# EAGLE design circuit (EAGLE 9.6.2)
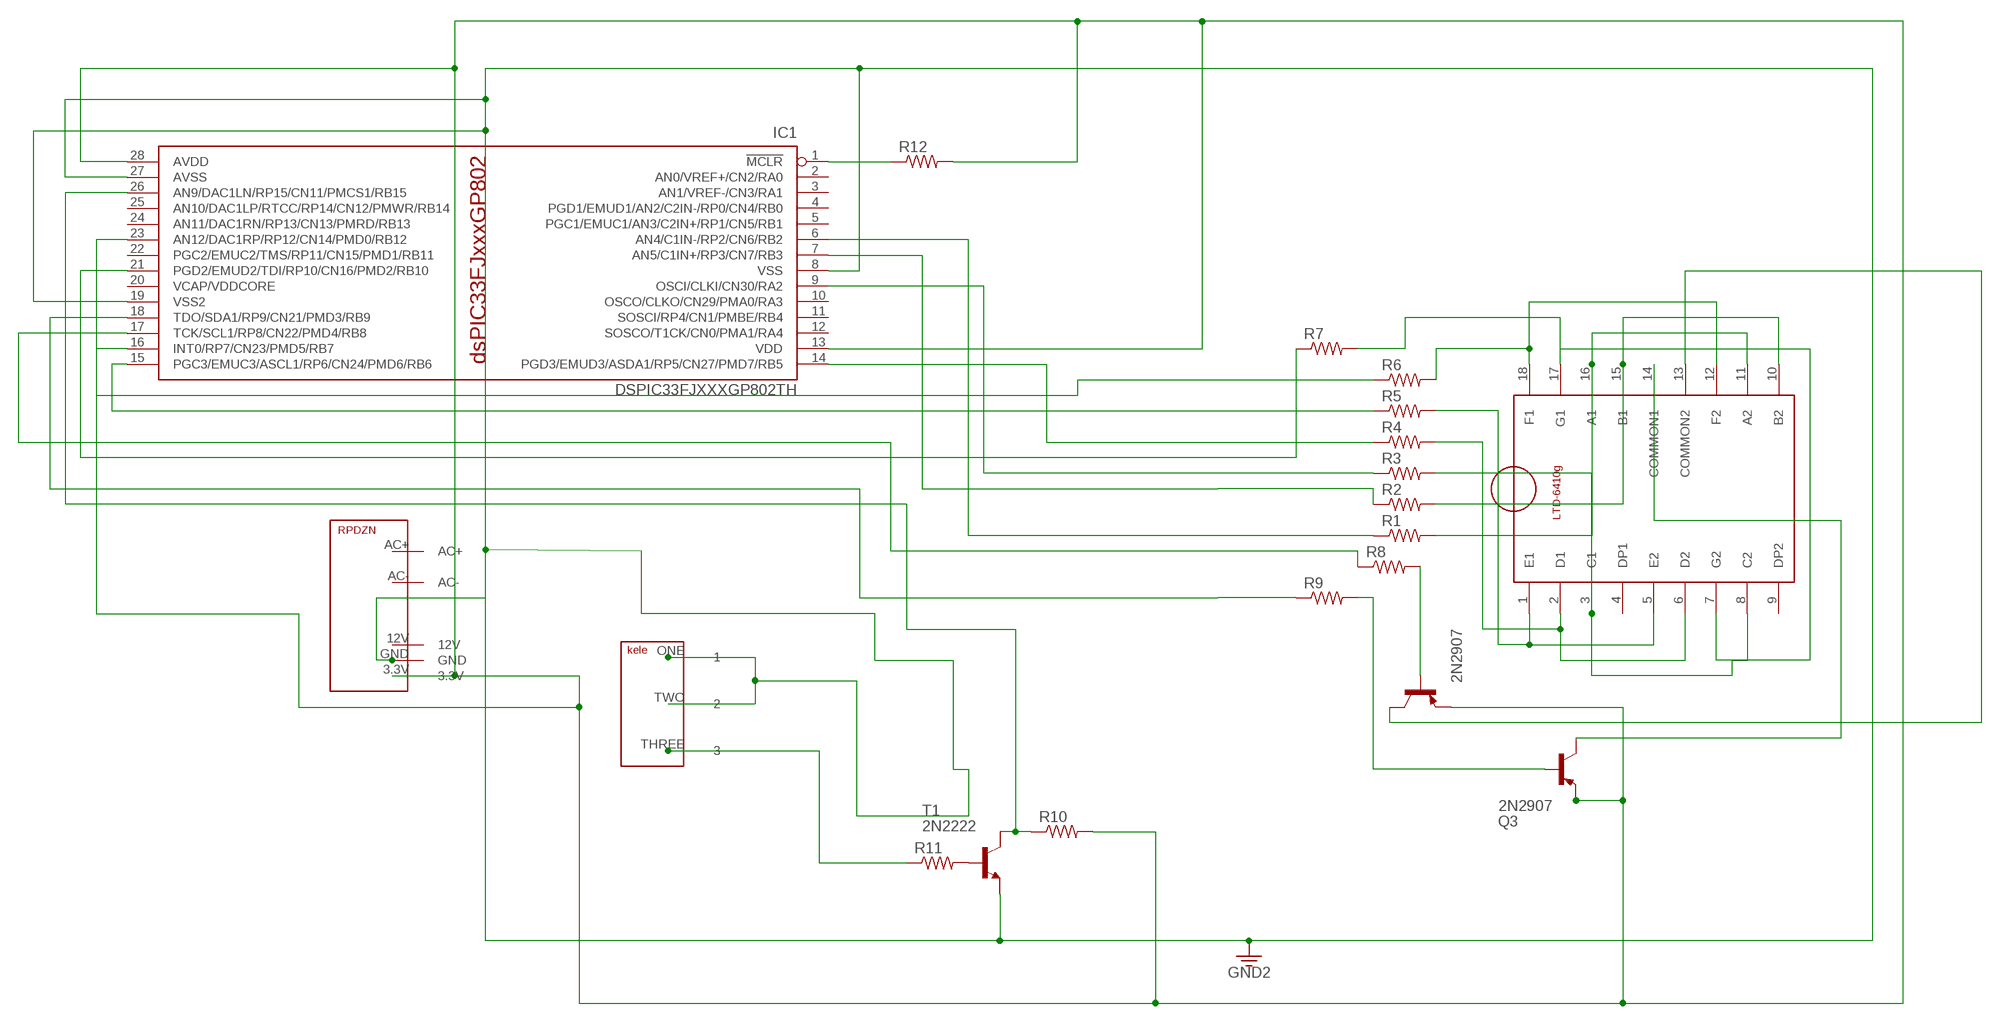
[diagram p0: schematic, sheet 1]

## Parts
IC1  DSPIC33FJXXXGP802TH  [DIL28-3]
Q1  2N2907  [TO92-EBC-OVAL]
Q3  2N2907  [TO92-EBC-OVAL]
R1  R-US_0207/9  [0207/9]
R2  R-US_0207/9  [0207/9]
R3  R-US_0207/9  [0207/9]
R4  R-US_0207/9  [0207/9]
R5  R-US_0207/9  [0207/9]
R6  R-US_0207/9  [0207/9]
R7  R-US_0207/9  [0207/9]
R8  R-US_0207/9  [0207/9]
R9  R-US_0207/9  [0207/9]
R10  R-US_0207/9  [0207/9]
R11  R-US_0207/9  [0207/9]
R12  R-US_0207/9  [0207/9]
T1  2N2222  [TO92-EBC-OVAL]
U$1  TERMINALTHROUGH-HOLE  [TERMINAL]
U$2  RODZN_AC-DC(3.3V)THROUGH-HOLE  [RODZN_AC-DC(3.3V)]
U$3  LIB-2THROUGH_HOLE  [LIB-2]

## Nets
GND: IC1.8(VSS) IC1.19(VSS2) IC1.27(AVSS) T1.E U$1.ONE U$1.TWO U$2.GND ; supply symbol labelled GND2
N$1: R1.2 U$3.11(A2) U$3.16(A1)
N$2: R5.2 U$3.1(E1) U$3.5(E2)
N$3: R3.2 U$3.3(C1) U$3.8(C2)
N$4: R4.2 U$3.2(D1) U$3.6(D2)
N$5: R7.2 U$3.7(G2) U$3.17(G1)
N$6: R2.2 U$3.10(B2) U$3.15(B1)
N$7: R6.2 U$3.12(F2) U$3.18(F1)
N$8: IC1.6(AN4/C1IN-/RP2/CN6/RB2) R1.1
N$9: Q1.C U$3.13(COMMON2)
N$10: Q3.B R9.2
N$11: Q1.B R8.2
N$12: IC1.1(!MCLR) R12.1
N$13: IC1.9(OSCI/CLKI/CN30/RA2) R3.1
N$14: IC1.13(VDD) IC1.23(AN12/DAC1RP/RP12/CN14/PMD0/RB12) IC1.28(AVDD) Q1.E Q3.E R10.2 R12.2 U$2.3.3V
N$15: IC1.14(PGD3/EMUD3/ASDA1/RP5/CN27/PMD7/RB5) R4.1
N$17: IC1.7(AN5/C1IN+/RP3/CN7/RB3) R2.1
N$18: IC1.15(PGC3/EMUC3/ASCL1/RP6/CN24/PMD6/RB6) R5.1
N$19: IC1.26(AN9/DAC1LN/RP15/CN11/PMCS1/RB15) R10.1 T1.C
N$20: IC1.16(INT0/RP7/CN23/PMD5/RB7) R6.1
N$21: IC1.21(PGD2/EMUD2/TDI/RP10/CN16/PMD2/RB10) R7.1
N$22: IC1.17(TCK/SCL1/RP8/CN22/PMD4/RB8) R8.1
N$24: R11.2 T1.B
N$25: IC1.18(TDO/SDA1/RP9/CN21/PMD3/RB9) R9.1
N$27: Q3.C U$3.14(COMMON1)
N$29: R11.1 U$1.THREE
Unconnected: IC1.2(AN0/VREF+/CN2/RA0) IC1.3(AN1/VREF-/CN3/RA1) IC1.4(PGD1/EMUD1/AN2/C2IN-/RP0/CN4/RB0) IC1.5(PGC1/EMUC1/AN3/C2IN+/RP1/CN5/RB1) IC1.10(OSCO/CLKO/CN29/PMA0/RA3) IC1.11(SOSCI/RP4/CN1/PMBE/RB4) IC1.12(SOSCO/T1CK/CN0/PMA1/RA4) IC1.22(PGC2/EMUC2/TMS/RP11/CN15/PMD1/RB11) IC1.24(AN11/DAC1RN/RP13/CN13/PMRD/RB13) IC1.25(AN10/DAC1LP/RTCC/RP14/CN12/PMWR/RB14) U$2.12V U$2.AC+ U$2.AC- U$3.4(DP1) U$3.9(DP2)

## Power pins joined to a net without a drawn wire
VCAP/VDDCORE: IC1.20(VCAP/VDDCORE)

## Library data of the parts
IC1 = microchip-dspic33:DSPIC33FJXXXGP802: High-Performance, 16-bit Digital Signal Controllers - dsPIC33FJ64GP802 & dsPIC33FJ128GP802 Source: http://ww1.microchip.com/downloads/en/DeviceDoc/70292B.pdf Operating Range: . Up to 40 MIPS operation (at 3.0-3.6V): - Industrial temperature range (-40°C to +85°C) - Extended temperature range (-40°C to +125°C) High-Performance DSC CPU: . Modified Harvard architecture . C compiler optimized instruction set . 16-bit wide data path . 24-bit wide instructions . Linear program memory addressing up to 4M instruction words . Linear data memory addressing up to 64 Kbytes . 83 base instructions: mostly 1 word/1 cycle . Two 40-bit accumulators with rounding and saturation options . Flexible and powerful addressing modes: - Indirect - Modulo - Bit-Reversed . Software stack . 16 x 16 fractional/integer multiply operations . 32/16 and 16/16 divide operations . Single-cycle multiply and accumulate: - Accumulator write back for DSP operations - Dual data fetch . Up to ±16-bit shifts for up to 40-bit data On-Chip Flash and SRAM: . Flash program memory . Data SRAM . Boot, Secure, and General Security for program Flash Direct Memory Access (DMA): . 8-channel hardware DMA . Up to 2 Kbytes dual ported DMA buffer area (DMA RAM) to store data transferred via DMA: - Allows data transfer between RAM and a peripheral while CPU is executing code (no cycle stealing) . Most peripherals support DMA Timers/Capture/Compare/PWM: . Timer/Counters, up to five 16-bit timers: - Can pair up to make two 32-bit timers - One timer runs as a Real-Time Clock with an external 32.768 kHz oscillator - Programmable prescaler . Input Capture (up to four channels): - Capture on up, down or both edges - 16-bit capture input functions - 4-deep FIFO on each capture . Output Compare (up to four channels): - Single or Dual 16-bit Compare mode - 16-bit Glitchless PWM mode . Hardware Real-Time Clock/Calendar (RTCC): - Provides clock, calendar, and alarm functions Interrupt Controller: . 5-cycle latency . 118 interrupt vectors . Up to 49 available interrupt sources . Up to three external interrupts . Seven programmable priority levels . Five processor exceptions Digital I/O: . Peripheral pin Select functionality . Up to 35 programmable digital I/O pins . Wake-up/Interrupt-on-Change for up to 21 pins . Output pins can drive from 3.0V to 3.6V . Up to 5V output with open drain configuration . All digital input pins are 5V tolerant . 4 mA sink on all I/O pins System Management: . Flexible clock options: - External, crystal, resonator, internal RC - Fully integrated Phase-Locked Loop (PLL) - Extremely low jitter PLL . Power-up Timer . Oscillator Start-up Timer/Stabilizer . Watchdog Timer with its own RC oscillator . Fail-Safe Clock Monitor . Reset by multiple sources Power Management: . On-chip 2.5V voltage regulator . Switch between clock sources in real time . Idle, Sleep, and Doze modes with fast wake-up Analog-to-Digital Converters (ADCs): . 10-bit, 1.1 Msps or 12-bit, 500 Ksps conversion: - Two and four simultaneous samples (10-bit ADC) - Up to 13 input channels with auto-scanning - Conversion start can be manual or synchronized with one of four trigger sources - Conversion possible in Sleep mode - ±2 LSb max integral nonlinearity - ±1 LSb max differential nonlinearity Audio Digital-to-Analog Converter (DAC): . 16-bit Dual Channel DAC module . 100 Ksps maximum sampling rate . Second-Order Digital Delta-Sigma Modulator Data Converter Interface (DCI) module: . Codec interface . Supports I2S and AC.97 protocols . Up to 16-bit data words, up to 16 words per frame . 4-word deep TX and RX buffers Comparator Module: . Two analog comparators with programmable input/output configuration CMOS Flash Technology: . Low-power, high-speed Flash technology . Fully static design . 3.3V (±10%) operating voltage . Industrial and Extended temperature . Low power consumption Communication Modules: . 4-wire SPI (up to two modules): - Framing supports I/O interface to simple codecs - Supports 8-bit and 16-bit data - Supports all serial clock formats and sampling modes . I2C?: - Full Multi-Master Slave mode support - 7-bit and 10-bit addressing - Bus collision detection and arbitration - Integrated signal conditioning - Slave address masking . UART (up to two modules): - Interrupt on address bit detect - Interrupt on UART error - Wake-up on Start bit from Sleep mode - 4-character TX and RX FIFO buffers - LIN bus support - IrDA® encoding and decoding in hardware - High-Speed Baud mode - Hardware Flow Control with CTS and RTS . Enhanced CAN (ECAN. module) 2.0B active: - Up to eight transmit and up to 32 receive buffers - 16 receive filters and three masks - Loopback, Listen Only and Listen All - Messages modes for diagnostics and bus monitoring - Wake-up on CAN message - Automatic processing of Remote Transmission Requests - FIFO mode using DMA - DeviceNet. addressing support . Parallel Master Slave Port (PMP/EPSP): - Supports 8-bit or 16-bit data - Supports 16 address lines . Programmable Cyclic Redundancy Check (CRC): - Programmable bit length for the CRC generator polynomial (up to 16-bit length) - 8-deep, 16-bit or 16-deep, 8-bit FIFO for data input
Q1 Q3 = adafruit:2N2907*: PNP Transistor Big Oval pads
R1-R12 = adafruit:R-US_: RESISTOR, American symbol
T1 = adafruit:2N2222: NPN TRANSISTOR Big oval pads
U$1 = TERMINAL:TERMINAL
U$2 = RPDZN_AC-DC(3.3V):RODZN_AC-DC(3.3V)
U$3 = LIB-2:LIB-2

## Net classes
0 default: width 0.813 mm, drill 0.762 mm, clearance 0.711 mm

## Board
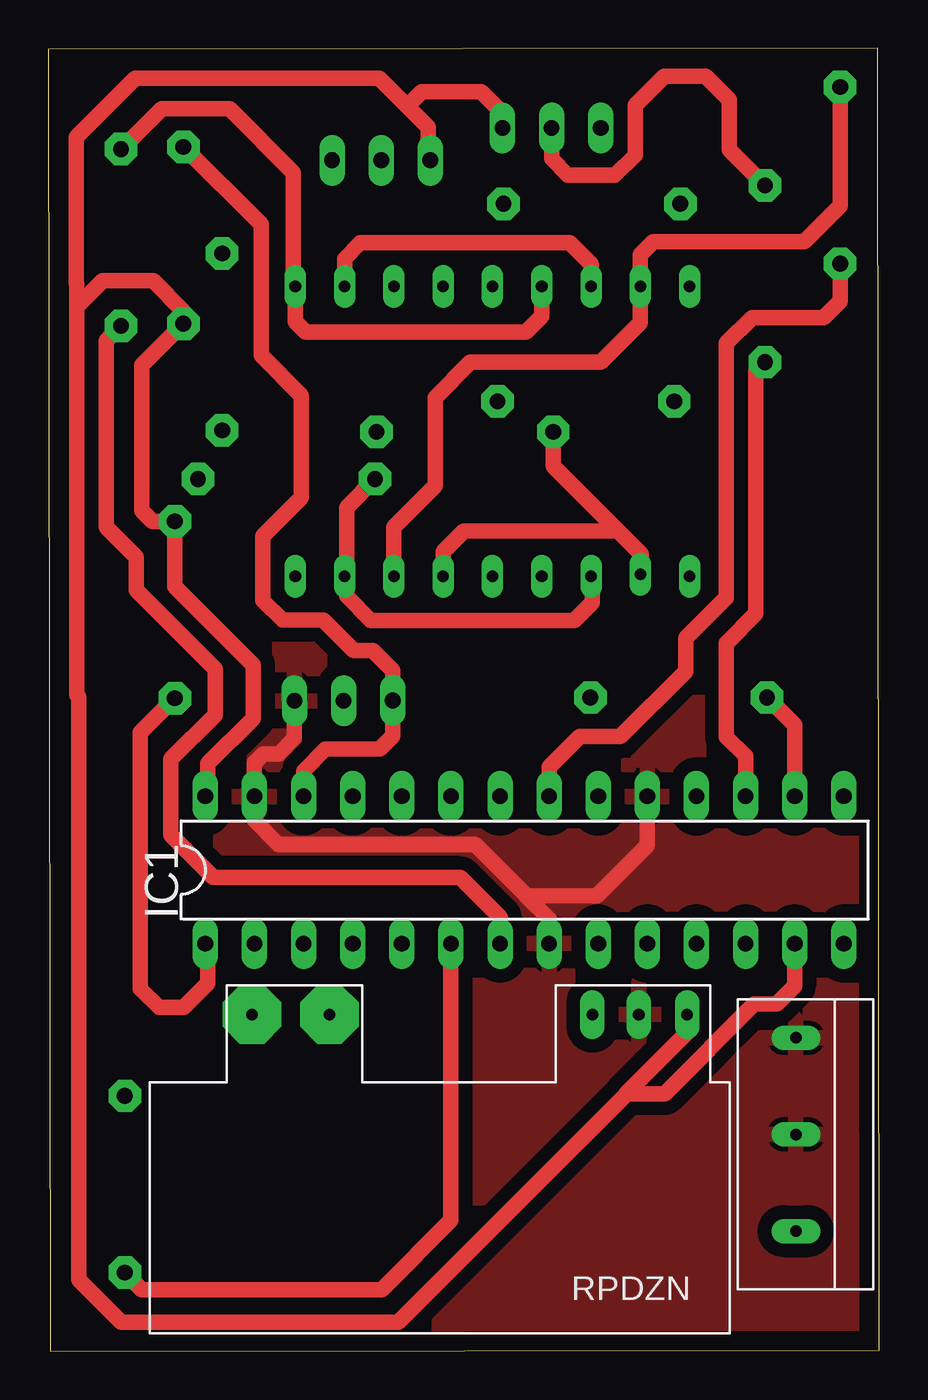
[diagram p1: board, top side]
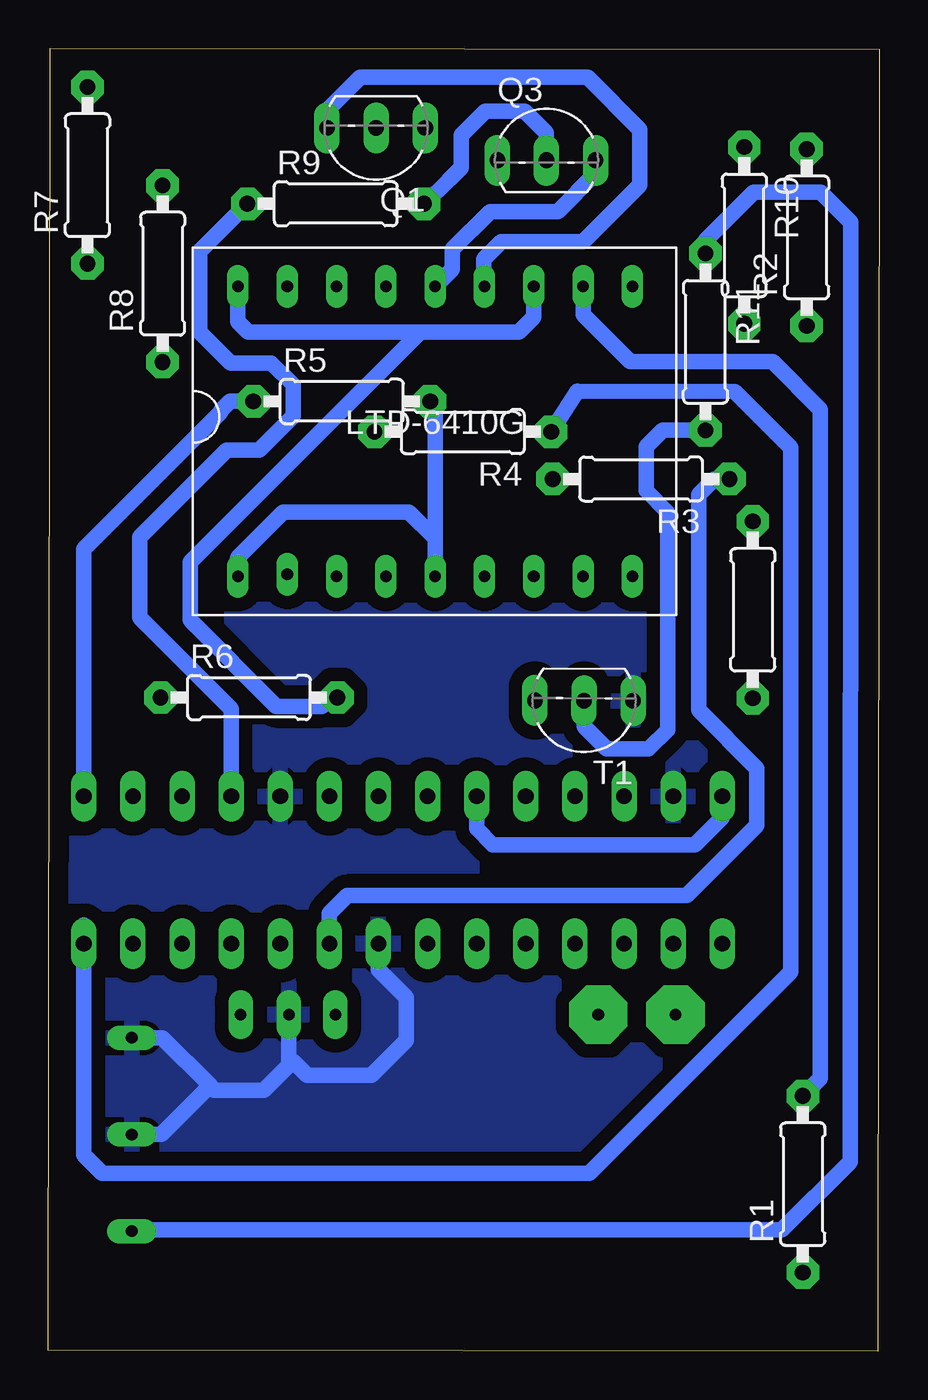
[diagram p2: board, bottom side, seen from below]

Size 42.97 x 67.4 mm. Coordinates in mm from the lower left corner, seen from the top.
Outline: 0.09,0 42.97,0.05 42.88,67.41 0,67.36 0.09,0
Copper layers (1*16): Top 0.035mm / dielectric 1.5mm / Bottom 0.035mm
Design rules "default": minimum track width 6mil, minimum drill 0.35mm, track to track 6mil, track to pad 6mil, pad to pad 6mil, via to via 6mil, smd to smd 6mil, copper to edge 40mil, drill to drill 6mil, minimum pad ring 10mil, minimum via ring 8mil, stop-mask expansion 4mil, vias tented up to drill 0mil, thermal gap 10mil

### Footprints (pad centres in the part's own frame; a part is rotated, then mirrored left to right if it is on the bottom)
DIL28-3 = drill 0.813 long: 1 -16.51,-3.81; 2 -13.97,-3.81; 3 -11.43,-3.81; 4 -8.89,-3.81; 5 -6.35,-3.81; 6 -3.81,-3.81; 7 -1.27,-3.81; 8 1.27,-3.81; 9 3.81,-3.81; 10 6.35,-3.81; 11 8.89,-3.81; 12 11.43,-3.81; 13 13.97,-3.81; 14 16.51,-3.81; 15 16.51,3.81; 16 13.97,3.81; 17 11.43,3.81; 18 8.89,3.81; 19 6.35,3.81; 20 3.81,3.81; 21 1.27,3.81; 22 -1.27,3.81; 23 -3.81,3.81; 24 -6.35,3.81; 25 -8.89,3.81; 26 -11.43,3.81; 27 -13.97,3.81; 28 -16.51,3.81
TO92-EBC-OVAL = drill 0.813 long: B 0,-1.27; C 2.54,-1.27; E -2.54,-1.27
0207/9 = drill 0.813 pad 1.676 octagon: 1 -4.572,0; 2 4.572,0
TERMINAL = drill 0.6 pad 1.27 long: ONE 2,3; THREE 12,3; TWO 7,3
RODZN_AC-DC(3.3V) = drill 0.6 pad 1.27 long: 3.3V 2.2,1.5; 12V 7.1,1.5; GND 4.7,1.5 | drill 0.6 pad 3.023 octagon: AC+ 24.7,1.5; AC- 20.7,1.5
LIB-2 = drill 0.6 long: 1 2.34,2; 2 4.89,2.11; 3 7.44,2; 4 9.99,2; 5 12.54,2; 6 15.09,2; 7 17.64,2; 8 20.19,2; 9 22.74,2; 10 22.74,17; 11 20.19,17; 12 17.64,17; 13 15.09,17; 14 12.54,17; 15 9.99,17; 16 7.44,17; 17 4.89,17; 18 2.34,17

### Placement (x,y rotation side)
IC1  24.63,24.89 0 top
Q1  26.02,62.01 180 bottom
Q3  17.21,62.88 0 bottom
R1  3.95,8.64 90 bottom
R2  3.75,57.62 90 bottom
R3  12.32,45.12 180 bottom
R4  21.54,47.57 180 bottom
R5  27.8,49.14 0 bottom
R6  32.6,33.82 0 bottom
R7  40.95,60.84 90 bottom
R8  37.06,55.74 90 bottom
R9  28.11,59.36 0 bottom
R10  6.98,57.73 270 bottom
R11  8.99,52.22 270 bottom
R12  6.54,38.35 90 bottom
T1  15.27,32.39 179.8 bottom
U$1  35.66,18.21 270 top
U$2  35.23,18.92 180 top
U$3  35.51,38.09 0 bottom

### Tracks (layer width: path | path; a pad name or v marks a point on that pad's centre or on a via)
GND
  Top 0.813: 24.75,23.55 22.09,26.22 11.9,26.22 10.64,27.48 10.66,27.49 IC1.27 10.66,30.44 11.12,30.9 11.91,30.9 12.73,31.71 T1.E 12.73,32.72 | IC1.19 30.98,26.16 28.37,23.55 24.75,23.55 | IC1.8 25.9,22.36 24.7,23.55 24.75,23.55
  Bottom 0.813: IC1.8 25.9,19.74 24.46,18.3 24.46,16.07 26.27,14.26 29.58,14.26 30.32,15 30.53,14.79 | 30.53,17.06 U$2.GND | U$2.GND 30.53,16.26 | U$1.TWO 37.14,11.21 34.61,13.75 | U$1.ONE 37.07,16.21 34.61,13.75 | 34.61,13.75 34.38,13.52 34.38,13.48 31.84,13.48 30.53,14.79 | U$2.GND 30.53,14.79 | 34.61,13.75
  pour Top: 0.09,0 43.27,0 43.27,67.31 0.09,67.31
  pour Bottom: 0.09,67.31 0.09,0 43.27,0 43.27,67.31
N$1
  Top 0.813: U$3.11 15.32,56.53 16.13,57.34 26.98,57.34 28.08,56.24 28.08,55.1 U$3.16
  Bottom 0.813: U$3.11 15.32,53.64 12.87,51.19 5.52,51.19 3.05,48.73 3.05,14.11 R1.2
N$2
  Bottom 0.813: 33.17,39.56 U$3.1 33.17,41.07 30.82,43.42 24.33,43.42 22.97,42.06 | 22.97,42.06 U$3.5 | 23.23,48.75 R5.2 22.97,48.88 22.97,42.06
N$3
  Top 0.813: 17.12,45.35 R3.2 15.42,43.66 15.42,39.99 | U$3.8 15.42,39.99 | 15.42,39.99 15.42,39.06 16.67,37.81 27.2,37.81 28.12,38.74 28.12,40.04 U$3.3
N$4
  Top 0.813: 29.48,42.42 21.48,42.42 20.42,41.36 U$3.6 | 29.48,42.42 30.66,41.24 30.66,41.13 30.62,41.09 30.66,41.05 30.62,41.01 U$3.2 | R4.2 26.11,45.79 29.48,42.42
N$5
  Top 0.813: 30.65,54.68 30.65,55.06 U$3.17 | U$3.17 30.62,53.21 28.57,51.16 21.83,51.16 20,49.33 20,44.77 17.87,42.64 U$3.7 | U$3.17 30.62,56.74 31.29,57.41 39.1,57.41 40.95,59.26 R7.2
N$6
  Top 0.813: U$3.15 25.52,53.54 24.7,52.72 13.31,52.72 12.77,53.26 U$3.10 12.66,55.19 12.66,60.98 9.37,64.27 5.86,64.27 3.78,62.19 R2.2
N$7
  Bottom 0.813: U$3.12 17.87,53.51 18.64,52.73 23.75,52.73 | U$3.18 33.17,53.26 32.64,52.73 23.75,52.73 | R6.2 28.03,34.16 28.83,33.36 31.17,33.36 35.64,37.83 35.64,40.84 23.75,52.73
N$8
  Top 0.813: R1.1 4.84,3.19 17.25,3.19 20.82,6.76 IC1.6
N$9
  Bottom 0.813: 20.5,55.01 U$3.13 20.45,55.12 20.45,56.5 19.54,57.4 15.31,57.4 12.38,60.33 12.38,63.21 15.08,65.91 26.84,65.91 28.56,64.19 Q1.C
N$10
  Bottom 0.813: Q3.B 17.21,63.03 18.34,64.16 20.38,64.16 21.63,62.91 21.63,61.23 22.24,60.62 | 22.24,60.62 22.27,60.62 | R9.2 23.5,59.37 22.24,60.62
N$11
  Top 0.813: Q1.B 26.02,61.69 26.87,60.84 29.3,60.84 30.34,61.89 30.34,64.45 31.86,65.97 33.99,65.97 35.21,64.75 35.21,62.17 R8.2
N$12
  Top 0.813: 8.12,20.16 IC1.1 8.24,20.97 8.24,19.02 7,17.78 5.73,17.78 4.77,18.74 4.77,32.01 R12.1
N$13
  Bottom 0.813: IC1.9 28.44,22.64 27.51,23.57 9.95,23.57 6.33,27.19 6.33,30.15 9.34,33.16 9.34,44.33 8.54,45.12 R3.1
N$14
  Top 0.813: 8.12,29.27 IC1.28 8.12,27.77 8.13,27.76 8.25,27.88 8.25,30.39 10.6,32.74 10.6,35.49 6.54,39.55 R12.2 5.41,42.93 4.84,43.49 4.84,51.02 R10.2 6.98,53.82 5.42,55.38 2.81,55.38 1.47,54.04 | 1.47,54.04 1.47,55.26 1.45,55.24 1.45,62.81 4.5,65.86 17.1,65.86 18.55,64.41 18.56,64.42 | 1.47,54.04 1.47,33.94 1.57,33.84 1.57,3.81 1.57,3.69 3.77,1.49 18.09,1.49 29.92,13.32 | Q3.E 19.64,61.72 19.64,63.33 18.56,64.42 | 18.56,64.42 19.3,65.16 22.39,65.16 23.5,64.04 23.5,63.3 Q1.E | IC1.13 38.6,18.9 37.66,17.96 36.51,17.96 31.87,13.32 29.92,13.32 | 29.92,13.32 29.87,13.32 33.03,16.48 U$2.3.3V
  Bottom 0.813: IC1.28 8.12,27.62 9.54,26.2 19.99,26.2 20.82,27.03 IC1.23
N$15
  Bottom 0.813: 41.14,22.06 IC1.14 41.14,10.16 40.18,9.21 14.99,9.21 4.58,19.62 4.58,46.75 7.48,49.66 15.62,49.66 R4.1
N$17
  Top 0.813: IC1.7 23.36,22.44 21.29,24.51 8.54,24.51 6.34,26.71 6.34,30.64 8.63,32.92 8.63,35.3 4.55,39.38 4.55,41.08 3,42.63 3,52.28 R2.1
N$18
  Bottom 0.813: IC1.15 41.14,41.51 34.05,48.59 34.05,48.66 33.58,49.14 R5.1
N$19
  Top 0.813: 13.17,28.73 IC1.26 13.2,30.03 14.31,31.14 17.13,31.14 17.81,31.82 T1.C 17.81,35.22 16.77,36.26 15.79,36.26 14.22,37.83 12.11,37.83 11.1,38.84 11.1,42.17 13.09,44.16 13.09,49.44 11,51.53 11,58.3 7,62.3 R10.1
N$20
  Top 0.813: R6.1 38.6,32.39 IC1.16
N$21
  Top 0.813: 35.07,39 35.07,38.96 | 35.07,39 32.95,36.88 32.95,35.17 29.58,31.8 27.48,31.8 25.9,30.21 IC1.21 | R7.1 40.95,54.33 40.11,53.48 36.39,53.48 35.07,52.16 35.07,39
N$22
  Top 0.813: R8.1 36.6,50.7 36.6,38.17 35.08,36.65 35.07,36.65 35.07,31.79 36.06,30.79 IC1.17
N$24
  Bottom 0.813: T1.B 15.27,32.31 14.11,31.15 11.95,31.15 10.95,32.15 10.93,43.4 12.05,44.51 12.05,46.8 11.2,47.65 R11.2
N$25
  Bottom 0.813: R9.1 35.14,56.91 35.14,52.73 33.53,51.13 31.44,51.13 30.31,50 30.31,48.37 32.08,46.61 33.76,46.61 38.26,42.11 38.26,37.95 33.52,33.22 IC1.18
N$27
  Bottom 0.813: Q3.C 14.67,60.93 16.64,58.96 20.13,58.96 22.09,57.01 22.09,55.97 U$3.14
N$29
  Bottom 0.813: 9.03,56.83 R11.1 8.99,57.45 6.49,59.95 3.03,59.95 1.48,58.4 1.5,9.8 5.04,6.27 38.6,6.27 U$1.THREE